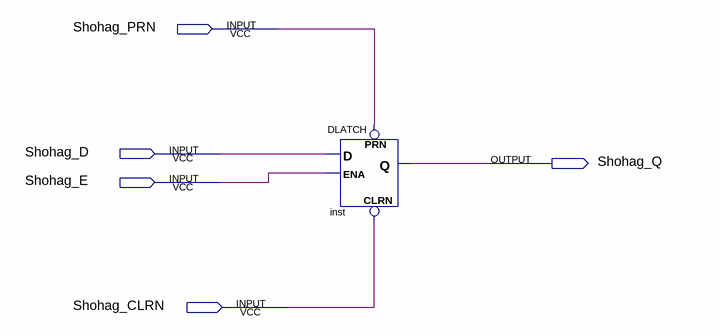
[diagram p0: schematic sheet]
// Quartus schematic Shohag_DLatch_block.bdf as structural Verilog: 1 symbols, 5 pins
module Shohag_DLatch_block (
  input  Shohag_PRN,
  input  Shohag_D,
  input  Shohag_E,
  input  Shohag_CLRN,
  output Shohag_Q
);

  DLATCH inst (.CLRN(Shohag_CLRN), .D(Shohag_D), .ENA(Shohag_E), .PRN(Shohag_PRN), .Q(Shohag_Q));
endmodule
